# Altium schematic sheet Micro_Conection.SchDoc (part 2 of 3)
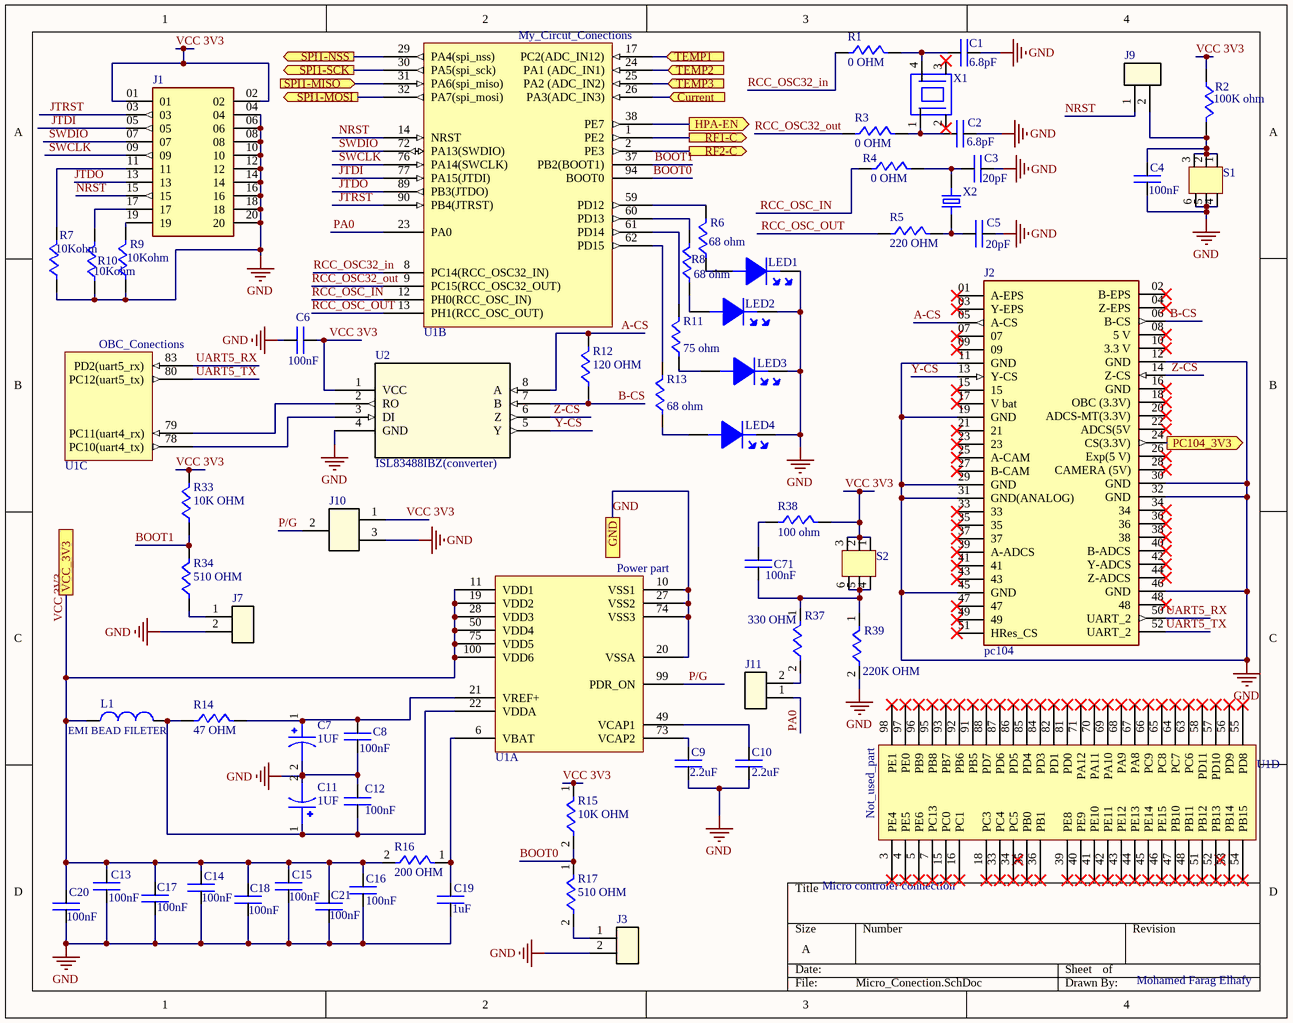
[diagram p1: Micro_Conection.SchDoc]
## Library data of the parts
C1 C2 = C_6.8pF: 6.8pF ±0.25pF 250V Ceramic Capacitor C0G, NP0 0805 (2012 Metric); Manufacturer: Yageo; Manufacturer Part Number: CC0805CRNPO0BN6R8; Supplier 1: Digi-Key; Stock 1: 10237; Pricing 1: 1 = 0.77000, 10 = 0.56500, 50 = 0.45220, 100 = 0.38760, 500 = 0.30682, 1000 = 0.25837 (USD); Mount: Surface Mount; Case/Package: 0805; Min Operating Temperature: -55°C; Max Operating Temperature: 125°C; Packaging: Tape and Reel; Voltage Rating: 100V; Length: 0.079inch; Width: 0.049inch; Thickness: 0.028inch; ComponentLink1URL: https://datasheet.ciiva.com/11611/product-11611526.pdf?src-supplier=Avnet; ComponentLink1Description: https://datasheet.ciiva.com/11611/product-11611526.pdf?src-supplier=Avnet; Supplier Part Number 1: 490-5292-1-ND; RoHS: Yes; Case Code (Imperial): 0805; Case Code (Metric): 2012; Package Quantity: 1; Dielectric: C0G; Termination: SMD/SMT; Voltage Rating (DC): 250V; Series: GQM; Construction: Flat; Height: 0.85mm; Depth: 1.25mm; Radiation Hardening: No; RoHS Compliant: Yes; ComponentLink2URL: https://datasheet.ciiva.com/5424/product-5424762.pdf?src-supplier=Mouser; ComponentLink2Description: https://datasheet.ciiva.com/5424/product-5424762.pdf?src-supplier=Mouser; ComponentLink3URL: https://datasheet.ciiva.com/141/partnumbering-e-01-141709.pdf?src-supplier=Digi-Key; ComponentLink3Description: https://datasheet.ciiva.com/141/partnumbering-e-01-141709.pdf?src-supplier=Digi-Key; ComponentLink4URL: https://datasheet.ciiva.com/141/partnumbering-e-01-141710.pdf?src-supplier=Digi-Key; ComponentLink4Description: https://datasheet.ciiva.com/141/partnumbering-e-01-141710.pdf?src-supplier=Digi-Key; ComponentLink5URL: https://datasheet.ciiva.com/141/partnumbering-e-01-141711.pdf?src-supplier=Digi-Key; ComponentLink5Description: https://datasheet.ciiva.com/141/partnumbering-e-01-141711.pdf?src-supplier=Digi-Key
C3 C5 = C_20pF: 20pF ±1% 25V Ceramic Capacitor C0G, NP0 0603 (1608 Metric); Manufacturer: Yageo; Manufacturer Part Number: CC0805CRNPO0BN6R8; Voltage Rating: 100V; Voltage Rating (DC): 16V; Tolerance: 5%; Mount: Surface Mount; Case/Package: 0805; Min Operating Temperature: -55°C; Max Operating Temperature: 125°C; Packaging: Tape and Reel; Length: 0.079inch; Width: 0.049inch; Thickness: 0.028inch; RoHS: Yes; Case Code (Imperial): 0805; Case Code (Metric): 2012; Weight: 0.000194oz; Dielectric Material: Ceramic; Package Quantity: 1; Dielectric: C0G; Termination: SMD/SMT; Height: 0.78mm; Depth: 1.25mm; Lead Free: Lead Free; Supplier 1: Digi-Key; ComponentLink1URL: https://datasheet.ciiva.com/11546/ccog-11546630.pdf?src-supplier=Avnet; ComponentLink1Description: https://datasheet.ciiva.com/11546/ccog-11546630.pdf?src-supplier=Avnet; ComponentLink2URL: https://datasheet.ciiva.com/5445/ccog-5445511.pdf?src-supplier=Mouser; ComponentLink2Description: https://datasheet.ciiva.com/5445/ccog-5445511.pdf?src-supplier=Mouser; ComponentLink3URL: https://datasheet.ciiva.com/203/ccog-203979.pdf?src-supplier=Digi-Key; ComponentLink3Description: https://datasheet.ciiva.com/203/ccog-203979.pdf?src-supplier=Digi-Key; Supplier Part Number 1: 399-9987-1-ND; Number of Pins: 2; Radiation Hardening: No
C4 C6 C8 C12-C18 C20 C21 C71 = C_100nF: 0.1µF ±10% 16V Ceramic Capacitor X7R 0805 (2012 Metric); Manufacturer: Johanson; Manufacturer Part Number: 160R15W104KV4T; Supplier 1: Digi-Key; RoHS: Yes; Stock 1: 45779; Pricing 1: 1 = 0.21000, 10 = 0.14200, 50 = 0.08520, 100 = 0.07190, 500 = 0.04920, 1000 = 0.04352 (USD); Mount: Surface Mount; Case/Package: 0805; Case Code (Imperial): 0805; Case Code (Metric): 2012; Min Operating Temperature: -55°C; Max Operating Temperature: 125°C; Tolerance: 10%; Packaging: Tape and Reel; Voltage Rating: 16V; Dielectric: X7R; Termination: SMD/SMT; Voltage Rating (DC): 16V; Package Quantity: 1; Length: 0.08inch; Width: 0.05inch; Thickness: 0.05inch; ComponentLink1URL: https://www.johansondielectrics.com/downloads/catalog/johanson-dielectrics-product-catalog.pdf; ComponentLink1Description: https://www.johansondielectrics.com/downloads/catalog/johanson-dielectrics-product-catalog.pdf; Supplier Part Number 1: 709-1183-1-ND; Series: -; RoHS Compliant: Yes
C7 C11 = C_1uF 1206: 1µF Molded Tantalum Capacitors 16V 1206 (3216 Metric) 11Ohm; Supplier 1: Future Electronics; Supplier Part Number 1: 4630448
C9 C10 = C_2.2uF: 2.2µF ±10% 25V Ceramic Capacitor X7R 0805 (2012 Metric); Manufacturer: Murata; Manufacturer Part Number: GRM21BR71E225KE11L; Voltage Rating: 6.3V; Supplier 1: Digi-Key; RoHS: No; Tolerance: 10%; Dielectric: X7R; Voltage Rating (DC): 25V; Length: 2mm; Width: 1.25mm; Thickness: 1.25mm; ComponentLink1URL: https://datasheet.ciiva.com/135/mlcc-all-e-135172.pdf?src-supplier=Digi-Key; ComponentLink1Description: https://datasheet.ciiva.com/135/mlcc-all-e-135172.pdf?src-supplier=Digi-Key; ComponentLink2URL: https://datasheet.ciiva.com/135/mlcc-all-e-135173.pdf?src-supplier=Digi-Key; ComponentLink2Description: https://datasheet.ciiva.com/135/mlcc-all-e-135173.pdf?src-supplier=Digi-Key; ComponentLink3URL: https://datasheet.ciiva.com/135/mlcc-all-e-135174.pdf?src-supplier=Digi-Key; ComponentLink3Description: https://datasheet.ciiva.com/135/mlcc-all-e-135174.pdf?src-supplier=Digi-Key; ComponentLink4URL: https://datasheet.ciiva.com/5423/mlcc-all-e-541559-5423227.pdf?src-supplier=Mouser; ComponentLink4Description: https://datasheet.ciiva.com/5423/mlcc-all-e-541559-5423227.pdf?src-supplier=Mouser; Supplier Part Number 1: 445-14535-1-ND; Mount: Surface Mount; Case/Package: 0805; Case Code (Metric): 2012; Case Code (Imperial): 0805; Min Operating Temperature: -55°C; Max Operating Temperature: 85°C; Packaging: Tape and Reel; Package Quantity: 1; Termination: SMD/SMT; Resistor Type: Ceramic; Height: 1.25mm; Depth: 1.25mm; Radiation Hardening: No; Lead Free: Lead Free
C19 = C_1uF: 1µF ±5% 16V Ceramic Capacitor X7R 0805 (2012 Metric); Manufacturer: Murata; Manufacturer Part Number: GRM219R61H105KA73D; Tolerance: 10%; Voltage Rating: 50V; Dielectric: X5R; Dissipation Factor: 0.025%; Supplier 1: Digi-Key; RoHS: Yes; Stock 1: 54905; Pricing 1: 1 = 0.38000, 10 = 0.26100, 50 = 0.17420, 100 = 0.14810, 500 = 0.10454, 1000 = 0.09148 (USD); Mount: Surface Mount; Case/Package: 0805; Number of Pins: 2; Case Code (Metric): 2012; Case Code (Imperial): 0805; Material: Ceramic; Weight: 0.000335oz; Dielectric Material: Ceramic; Min Operating Temperature: -55°C; Max Operating Temperature: 85°C; Packaging: Tape and Reel; Voltage: 50V; Termination: SMD/SMT; Resistor Type: Ceramic; Voltage Rating (DC): 50V; Package Quantity: 4000; Length: 2mm; Width: 1.25mm; Height: 0.85mm; Thickness: 0.037inch; Depth: 1.25mm; REACH SVHC: No SVHC; Lead Free: Lead Free; ComponentLink1URL: http://www.farnell.com/datasheets/2746093.pdf?src-supplier=Farnell; ComponentLink1Description: http://www.farnell.com/datasheets/2746093.pdf?src-supplier=Farnell; Supplier Part Number 1: 399-8001-1-ND; Features: Soft Termination; Ratings: AEC-Q200; Radiation Hardening: No; Series: C; Construction: Flat; Lead Pitch: 0.75mm; RoHS Compliant: Yes
J1 = JTAG: Connector Header Through Hole 20 position 0.100" (2.54mm); Supplier 1: Digi-Key; Supplier Part Number 1: 609-1776-ND; ComponentLink1URL: https://datasheet.ciiva.com/11746/0900766b80d79252-11746787.pdf?src-supplier=RSComponents; ComponentLink1Description: https://datasheet.ciiva.com/11746/0900766b80d79252-11746787.pdf?src-supplier=RSComponents; ComponentLink2URL: https://datasheet.ciiva.com/8046/8378-8046504.pdf?src-supplier=Element14; ComponentLink2Description: https://datasheet.ciiva.com/8046/8378-8046504.pdf?src-supplier=Element14; ComponentLink3URL: https://datasheet.ciiva.com/713/75869-713538.pdf?src-supplier=Digi-Key; ComponentLink3Description: https://datasheet.ciiva.com/713/75869-713538.pdf?src-supplier=Digi-Key; ComponentLink4URL: https://datasheet.ciiva.com/14640/70236764-14640853.pdf?src-supplier=Allied+Electronics; ComponentLink4Description: https://datasheet.ciiva.com/14640/70236764-14640853.pdf?src-supplier=Allied+Electronics; ComponentLink5URL: https://datasheet.ciiva.com/3118/75869-3118553.pdf?src-supplier=Avnet; ComponentLink5Description: https://datasheet.ciiva.com/3118/75869-3118553.pdf?src-supplier=Avnet
J3 J7 J9 J11 = jumber 2 leads: Connector Header Through Hole 2 position 0.100" (2.54mm); Manufacturer: Wurth Electronics; Manufacturer Part Number: 61300211121; Current Rating: 3A; Voltage Rating: 250V; Number of Positions: 2; Gender: Male; Connector Type: Male Pin; Pitch: 0.1inch; Supplier 1: Digi-Key; Supplier Part Number 1: 732-5315-ND; RoHS: Yes; Stock 1: 60555; Pricing 1: 1 = 0.13000, 10 = 0.10600, 25 = 0.08800, 50 = 0.07400, 100 = 0.06700, 1000 = 0.06100 (USD); Mount: Through Hole; Contact Plating: Gold; Housing Material: PBT; Contact Material: Copper Alloy,Copper; Color: Black; Min Operating Temperature: -40°C; Max Operating Temperature: 125°C; Number of Rows: 1; Contact Gender: Male; Packaging: Bulk; Termination: Through Hole; Number of Contacts: 2; Contact Mating Length: 0.236inch; REACH SVHC: Unknown; Lead Free: Lead Free; ComponentLink1URL: https://datasheet.ciiva.com/13619/6130xx11121-48870-13619345.pdf?src-supplier=Mouser; ComponentLink1Description: https://datasheet.ciiva.com/13619/6130xx11121-48870-13619345.pdf?src-supplier=Mouser
J10 = jumber: Connector Header Through Hole 3 position 0.100" (2.54mm); Manufacturer: Harwin; Manufacturer Part Number: M20-9990345; Contact Resistance: 25mR; Max Current Rating: 3A; Number of Positions: 3; Connector Type: Male Pin; Insulation Resistance: 10GR; Voltage Rating (AC): 750V; Gender: Male; RoHS: Yes; Mount: Through Hole; Case/Package: SIL; Contact Material: Brass,Bronze; Color: Black; Housing Color: Black; Housing Material: Nylon; Contact Plating: Gold; Weight: 0.006138oz; Min Operating Temperature: -40°C; Max Operating Temperature: 105°C; Number of Rows: 1; Package Quantity: 1000; Packaging: Bulk; Termination: Solder; Number of Contacts: 3; Orientation: Straight; Current Rating: 3A; Series: M20; Contact Type: Male Pin; Length: 7.62mm; Width: 0.25inch; Height: 0.125inch; Pitch: 2.54mm; Depth: 2.54mm; Contact Mating Length: 0.24inch; Radiation Hardening: No; REACH SVHC: No SVHC; RoHS Compliant: Yes; Supplier 1: Digi-Key; Stock 1: 36526; Pricing 1: 1 = 0.13000, 10 = 0.10600, 25 = 0.08800, 50 = 0.07400, 100 = 0.06700, 1000 = 0.06100 (USD); Lead Free: Lead Free; ComponentLink1URL: http://www.farnell.com/cad/1737268.pdf?src-supplier=Element14; ComponentLink1Description: http://www.farnell.com/cad/1737268.pdf?src-supplier=Element14; ComponentLink2URL: https://katalog.we-online.de/em/datasheet/6130xx11121.pdf?src-supplier=Digi-Key; ComponentLink2Description: https://katalog.we-online.de/em/datasheet/6130xx11121.pdf?src-supplier=Digi-Key; Supplier Part Number 1: 732-5316-ND
L1 = FCM1608-0603: 60 Ohms @ 100MHz 1 Power Line Ferrite Bead 0805 (2012 Metric) 3A 25mOhm; Supplier 1: Digi-Key; Supplier Part Number 1: 587-1932-1-ND
LED1 = LED_GREEN: Green 568nm LED Indication - Discrete 2V 0805 (2012 Metric); Manufacturer: Vishay Lite-On; Manufacturer Part Number: LTST-S220KGKT; Lens Color: Colorless; Viewing Angle: 130°; Luminous Intensity: 35mcd; Forward Current: 30mA; Lens Style: Diffused,Colorless,Rectangular,Clear; Power Rating: 75mW; Dominant Wavelength: 571nm; Test Current: 20mA; Number of Elements: 1; Wavelength: 574nm; Reverse Voltage: 5V; Supplier 1: Digi-Key; ComponentLink1Description: https://www.digikey.com/en/products/detail/lite-on-inc/LTST-C191KGKT/386835; ComponentLink1URL: https://www.digikey.com/en/products/detail/lite-on-inc/LTST-C191KGKT/386835; Supplier Part Number 1: 160-1468-1-ND; ComponentLink2Description: data sheet; ComponentLink2URL: https://optoelectronics.liteon.com/upload/download/DS22-2000-228/LTST-C191KGKT.PDF; RoHS: Yes; Stock 1: 90822; Pricing 1: 1 = 0.26000, 10 = 0.14200, 100 = 0.06600, 500 = 0.06090, 1000 = 0.04770, 2000 = 0.04669 (USD); Mount: Surface Mount; Case/Package: 0805; Number of Pins: 2; Color: Green; Case Code (Metric): 2012; Case Code (Imperial): 0805; Min Operating Temperature: -55°C; Max Operating Temperature: 85°C; Forward Voltage: 2V; Packaging: Tape and Reel; Package Quantity: 1; Illumination Color: Green; Lens Transparency: Clear; Power Dissipation: 75mW; Number of LEDs: 1; Length: 2.1mm; Width: 1mm; Height: 0.6mm; Depth: 0.6mm; Radiation Hardening: No; Lead Free: Lead Free; RoHS Compliant: Yes; ComponentLink3URL: https://datasheet.ciiva.com/11775/0900766b80dc0b70-11775441.pdf?src-supplier=RSComponents; ComponentLink3Description: https://datasheet.ciiva.com/11775/0900766b80dc0b70-11775441.pdf?src-supplier=RSComponents; ComponentLink4URL: https://datasheet.ciiva.com/12400/100-ltst-s220kgkt-59602-12400886.pdf?src-supplier=Mouser; ComponentLink4Description: https://datasheet.ciiva.com/12400/100-ltst-s220kgkt-59602-12400886.pdf?src-supplier=Mouser; ComponentLink5URL: https://datasheet.ciiva.com/2110/s-110-ltst-s220kgkt-2110069.pdf?src-supplier=Digi-Key; ComponentLink5Description: https://datasheet.ciiva.com/2110/s-110-ltst-s220kgkt-2110069.pdf?src-supplier=Digi-Key; ComponentLink6URL: https://datasheet.ciiva.com/2110/s-110-ltst-s220kgkt-2110070.pdf?src-supplier=Digi-Key; ComponentLink6Description: https://datasheet.ciiva.com/2110/s-110-ltst-s220kgkt-2110070.pdf?src-supplier=Digi-Key; ComponentLink7URL: https://datasheet.ciiva.com/2110/s-110-ltst-s220kgkt-2110071.pdf?src-supplier=Digi-Key; ComponentLink7Description: https://datasheet.ciiva.com/2110/s-110-ltst-s220kgkt-2110071.pdf?src-supplier=Digi-Key; ComponentLink8URL: https://datasheet.ciiva.com/16379/ltst-s220kgkt-16379082.pdf?src-supplier=Future+Electronics; ComponentLink8Description: https://datasheet.ciiva.com/16379/ltst-s220kgkt-16379082.pdf?src-supplier=Future+Electronics
LED2 = LED_ORANGE: Orange 605nm LED Indication - Discrete 2V 0805 (2012 Metric); Manufacturer: Vishay Lite-On; Manufacturer Part Number: LTST-C170KFKT; Lens Color: Colorless; Wavelength: 611nm; Number of LEDs: 1; Viewing Angle: 130°; Lens Style: Diffused,Colorless,Rectangular,Clear; Luminous Intensity: 60mcd; Forward Current: 30mA; Power Rating: 75mW; Reverse Voltage: 5V; Test Current: 20mA; ComponentLink1Description: https://www.digikey.com/en/products/detail/lite-on-inc/LTST-C191KGKT/386835; ComponentLink1URL: https://www.digikey.com/en/products/detail/lite-on-inc/LTST-C191KGKT/386835; ComponentLink2Description: data sheet; ComponentLink2URL: https://optoelectronics.liteon.com/upload/download/DS22-2000-228/LTST-C191KGKT.PDF; RoHS: Yes; Mount: Surface Mount; Case/Package: 0805; Number of Pins: 2; Case Code (Metric): 2012; Color: Orange; Case Code (Imperial): 0805; Min Operating Temperature: -55°C; Max Operating Temperature: 85°C; Package Quantity: 1; Packaging: Tape and Reel; Forward Voltage: 2V; Illumination Color: Orange; Dominant Wavelength: 605nm; Lens Transparency: Clear; Number of Elements: 1; Power Dissipation: 75mW; Length: 3.2mm; Width: 1.25mm; Height: 1.1mm; Depth: 1.6mm; Radiation Hardening: No; Lead Free: Lead Free; ComponentLink3URL: https://datasheet.ciiva.com/2109/ltst-c191kfkt-2109968.pdf?src-supplier=Digi-Key; ComponentLink3Description: https://datasheet.ciiva.com/2109/ltst-c191kfkt-2109968.pdf?src-supplier=Digi-Key; ComponentLink4URL: https://datasheet.ciiva.com/12400/100-ltst-c191kfkt-39904-12400811.pdf?src-supplier=Mouser; ComponentLink4Description: https://datasheet.ciiva.com/12400/100-ltst-c191kfkt-39904-12400811.pdf?src-supplier=Mouser; ComponentLink5URL: https://datasheet.ciiva.com/11775/0900766b80dc02b0-11775613.pdf?src-supplier=RSComponents; ComponentLink5Description: https://datasheet.ciiva.com/11775/0900766b80dc02b0-11775613.pdf?src-supplier=RSComponents; ComponentLink6URL: https://datasheet.ciiva.com/15201/getdatasheetpartid-631075-15201391.pdf?src-supplier=Verical; ComponentLink6Description: https://datasheet.ciiva.com/15201/getdatasheetpartid-631075-15201391.pdf?src-supplier=Verical; ComponentLink7URL: https://datasheet.ciiva.com/2109/s-110-ltst-c191kfkt-2109969.pdf?src-supplier=Digi-Key; ComponentLink7Description: https://datasheet.ciiva.com/2109/s-110-ltst-c191kfkt-2109969.pdf?src-supplier=Digi-Key; Supplier 1: Digi-Key; Stock 1: 7029; Pricing 1: 1 = 0.28000, 10 = 0.15000, 100 = 0.06990, 500 = 0.06450, 1000 = 0.05052 (USD); Supplier Part Number 1: 160-1413-1-ND; RoHS Compliant: Yes; ComponentLink8URL: https://datasheet.ciiva.com/15117/getdatasheetpartid-158266-15117926.pdf?src-supplier=Verical; ComponentLink8Description: https://datasheet.ciiva.com/15117/getdatasheetpartid-158266-15117926.pdf?src-supplier=Verical; ComponentLink9URL: https://datasheet.ciiva.com/11773/0900766b80dc0279-11773662.pdf?src-supplier=RSComponents; ComponentLink9Description: https://datasheet.ciiva.com/11773/0900766b80dc0279-11773662.pdf?src-supplier=RSComponents; ComponentLink10URL: https://datasheet.ciiva.com/12403/lite-on-ltst-c170kfkt-187690-12403821.pdf?src-supplier=Mouser; ComponentLink10Description: https://datasheet.ciiva.com/12403/lite-on-ltst-c170kfkt-187690-12403821.pdf?src-supplier=Mouser; ComponentLink11URL: https://datasheet.ciiva.com/2110/s-110-ltst-c170kfkt-2110076.pdf?src-supplier=Digi-Key; ComponentLink11Description: https://datasheet.ciiva.com/2110/s-110-ltst-c170kfkt-2110076.pdf?src-supplier=Digi-Key; ComponentLink12URL: https://datasheet.ciiva.com/2110/s-110-ltst-c170kfkt-2110077.pdf?src-supplier=Digi-Key; ComponentLink12Description: https://datasheet.ciiva.com/2110/s-110-ltst-c170kfkt-2110077.pdf?src-supplier=Digi-Key; ComponentLink13URL: https://datasheet.ciiva.com/2110/s-110-ltst-c170kfkt-2110075.pdf?src-supplier=Digi-Key; ComponentLink13Description: https://datasheet.ciiva.com/2110/s-110-ltst-c170kfkt-2110075.pdf?src-supplier=Digi-Key; ComponentLink14URL: https://datasheet.ciiva.com/16427/ltst-c170kfkt-16427484.pdf?src-supplier=Future+Electronics; ComponentLink14Description: https://datasheet.ciiva.com/16427/ltst-c170kfkt-16427484.pdf?src-supplier=Future+Electronics
LED3 = LED_RED: Red 638nm LED Indication - Discrete 1.8V 0805 (2012 Metric); Manufacturer: Vishay Lite-On; Manufacturer Part Number: LTST-C170CKT; Lens Color: Colorless; Power Rating: 100mW; Luminous Intensity: 10mcd; Viewing Angle: 130°; Lens Style: Diffused,Colorless,Rectangular,Clear; Forward Current: 40mA; Test Current: 10mA; Number of Elements: 1; Wavelength: 660nm; Voltage: 5V; ComponentLink1Description: https://www.digikey.com/en/products/detail/lite-on-inc/LTST-C191KGKT/386835; ComponentLink1URL: https://www.digikey.com/en/products/detail/lite-on-inc/LTST-C191KGKT/386835; ComponentLink2Description: data sheet; ComponentLink2URL: https://optoelectronics.liteon.com/upload/download/DS22-2000-228/LTST-C191KGKT.PDF; Supplier 1: Digi-Key; RoHS: Yes; Stock 1: 26138; Pricing 1: 1 = 0.35000, 10 = 0.18800, 100 = 0.08740, 500 = 0.08070, 1000 = 0.06322 (USD); Mount: Surface Mount; Case/Package: 0805; Number of Pins: 2; Color: Red; Case Code (Metric): 2012; Case Code (Imperial): 0805; Min Operating Temperature: -55°C; Max Operating Temperature: 85°C; Packaging: Tape and Reel; Forward Voltage: 1.8V; Package Quantity: 1; Illumination Color: Red; Dominant Wavelength: 638nm; Lens Transparency: Clear; Power Dissipation: 100mW; Number of LEDs: 1; Reverse Voltage: 5V; Length: 2mm; Width: 1.25mm; Height: 1.1mm; Depth: 1.25mm; Radiation Hardening: No; Lead Free: Lead Free; ComponentLink3URL: https://datasheet.ciiva.com/11773/0900766b80dc02b2-11773601.pdf?src-supplier=RSComponents; ComponentLink3Description: https://datasheet.ciiva.com/11773/0900766b80dc02b2-11773601.pdf?src-supplier=RSComponents; ComponentLink4URL: https://datasheet.ciiva.com/16212/ltst-c191krkt-16212419.pdf?src-supplier=Future+Electronics; ComponentLink4Description: https://datasheet.ciiva.com/16212/ltst-c191krkt-16212419.pdf?src-supplier=Future+Electronics; ComponentLink5URL: https://datasheet.ciiva.com/15117/getdatasheetpartid-141922-15117737.pdf?src-supplier=Verical; ComponentLink5Description: https://datasheet.ciiva.com/15117/getdatasheetpartid-141922-15117737.pdf?src-supplier=Verical; ComponentLink6URL: https://datasheet.ciiva.com/12400/lite-on-ltst-c191krkt-190135-12400910.pdf?src-supplier=Mouser; ComponentLink6Description: https://datasheet.ciiva.com/12400/lite-on-ltst-c191krkt-190135-12400910.pdf?src-supplier=Mouser; ComponentLink7URL: https://datasheet.ciiva.com/2109/s-110-ltst-c191krkt-2109970.pdf?src-supplier=Digi-Key; ComponentLink7Description: https://datasheet.ciiva.com/2109/s-110-ltst-c191krkt-2109970.pdf?src-supplier=Digi-Key; ComponentLink8URL: https://datasheet.ciiva.com/2109/s-110-ltst-c191krkt-2109971.pdf?src-supplier=Digi-Key; ComponentLink8Description: https://datasheet.ciiva.com/2109/s-110-ltst-c191krkt-2109971.pdf?src-supplier=Digi-Key; ComponentLink9URL: https://datasheet.ciiva.com/2109/s-110-ltst-c191krkt-2109972.pdf?src-supplier=Digi-Key; ComponentLink9Description: https://datasheet.ciiva.com/2109/s-110-ltst-c191krkt-2109972.pdf?src-supplier=Digi-Key; Supplier Part Number 1: 160-1176-1-ND; Max Power Dissipation: 100mW; Series: -; RoHS Compliant: Yes; ComponentLink10URL: https://datasheet.ciiva.com/2110/ltst-c170ckt-2110087.pdf?src-supplier=Digi-Key; ComponentLink10Description: https://datasheet.ciiva.com/2110/ltst-c170ckt-2110087.pdf?src-supplier=Digi-Key; ComponentLink11URL: https://datasheet.ciiva.com/15117/getdatasheetpartid-121078-15117607.pdf?src-supplier=Verical; ComponentLink11Description: https://datasheet.ciiva.com/15117/getdatasheetpartid-121078-15117607.pdf?src-supplier=Verical; ComponentLink12URL: https://datasheet.ciiva.com/16199/lite-on20ltst-c170ckt-16199245.pdf?src-supplier=Future+Electronics; ComponentLink12Description: https://datasheet.ciiva.com/16199/lite-on20ltst-c170ckt-16199245.pdf?src-supplier=Future+Electronics; ComponentLink13URL: https://datasheet.ciiva.com/11775/0900766b80dc0276-11775646.pdf?src-supplier=RSComponents; ComponentLink13Description: https://datasheet.ciiva.com/11775/0900766b80dc0276-11775646.pdf?src-supplier=RSComponents; ComponentLink14URL: https://datasheet.ciiva.com/2110/ltst-c170ckt-2110088.pdf?src-supplier=Digi-Key; ComponentLink14Description: https://datasheet.ciiva.com/2110/ltst-c170ckt-2110088.pdf?src-supplier=Digi-Key; ComponentLink15URL: https://datasheet.ciiva.com/2110/ltst-c170ckt-2110089.pdf?src-supplier=Digi-Key; ComponentLink15Description: https://datasheet.ciiva.com/2110/ltst-c170ckt-2110089.pdf?src-supplier=Digi-Key; ComponentLink16URL: https://datasheet.ciiva.com/27051/1260306-27051787.pdf?src-supplier=Jameco; ComponentLink16Description: https://datasheet.ciiva.com/27051/1260306-27051787.pdf?src-supplier=Jameco
LED4 = LED_YELLOW: Yellow 591nm LED Indication - Discrete 2.1V 0805 (2012 Metric); Manufacturer: Vishay Lite-On; Manufacturer Part Number: LTST-C170KSKT; Lens Color: Colorless; Reverse Voltage: 5V; Number of LEDs: 1; Viewing Angle: 130°; Lens Style: Diffused,Colorless,Rectangular,Clear; Luminous Intensity: 112mcd; Forward Current: 30mA; Forward Voltage: 2.4V; Power Rating: 75mW; Wavelength: 588nm; Dominant Wavelength: 587nm; Test Current: 20mA; Supplier 1: Digi-Key; RoHS: Yes; Stock 1: 67488; Pricing 1: 1 = 0.31000, 10 = 0.16900, 100 = 0.07860, 500 = 0.07260, 1000 = 0.05687 (USD); Mount: Surface Mount; Case/Package: 0805; Number of Pins: 2; Case Code (Imperial): 0805; Color: Yellow; Case Code (Metric): 2012; Min Operating Temperature: -55°C; Max Operating Temperature: 85°C; Package Quantity: 1; Packaging: Tape and Reel; Illumination Color: Yellow; Lens Transparency: Clear; Number of Elements: 1; Power Dissipation: 75mW; Length: 2mm; Width: 1.25mm; Height: 1.1mm; Depth: 1.25mm; Radiation Hardening: No; Lead Free: Lead Free; ComponentLink1URL: https://datasheet.ciiva.com/16213/lite-on20ltst-c191kskt-16213725.pdf?src-supplier=Future+Electronics; ComponentLink1Description: https://datasheet.ciiva.com/16213/lite-on20ltst-c191kskt-16213725.pdf?src-supplier=Future+Electronics; ComponentLink2URL: https://datasheet.ciiva.com/12400/lite-on-ltst-c191kskt-190097-12400797.pdf?src-supplier=Mouser; ComponentLink2Description: https://datasheet.ciiva.com/12400/lite-on-ltst-c191kskt-190097-12400797.pdf?src-supplier=Mouser; ComponentLink3URL: https://datasheet.ciiva.com/15117/getdatasheetpartid-141495-15117732.pdf?src-supplier=Verical; ComponentLink3Description: https://datasheet.ciiva.com/15117/getdatasheetpartid-141495-15117732.pdf?src-supplier=Verical; ComponentLink4URL: https://datasheet.ciiva.com/11773/0900766b80dc02b3-11773512.pdf?src-supplier=RSComponents; ComponentLink4Description: https://datasheet.ciiva.com/11773/0900766b80dc02b3-11773512.pdf?src-supplier=RSComponents; ComponentLink5URL: https://datasheet.ciiva.com/2109/s-110-ltst-c191kskt-2109984.pdf?src-supplier=Digi-Key; ComponentLink5Description: https://datasheet.ciiva.com/2109/s-110-ltst-c191kskt-2109984.pdf?src-supplier=Digi-Key; Supplier Part Number 1: 160-1416-1-ND; Series: CHIPLED 0805; RoHS Compliant: Yes; ComponentLink6URL: https://datasheet.ciiva.com/15118/getdatasheetpartid-214541-15118098.pdf?src-supplier=Verical; ComponentLink6Description: https://datasheet.ciiva.com/15118/getdatasheetpartid-214541-15118098.pdf?src-supplier=Verical; ComponentLink7URL: https://datasheet.ciiva.com/11774/0900766b80dc027c-11774116.pdf?src-supplier=RSComponents; ComponentLink7Description: https://datasheet.ciiva.com/11774/0900766b80dc027c-11774116.pdf?src-supplier=RSComponents; ComponentLink8URL: https://datasheet.ciiva.com/16203/ltst-c170kskt-16203829.pdf?src-supplier=Future+Electronics; ComponentLink8Description: https://datasheet.ciiva.com/16203/ltst-c170kskt-16203829.pdf?src-supplier=Future+Electronics; ComponentLink9URL: https://datasheet.ciiva.com/12400/lite-on-ltst-c170kskt-187240-12400806.pdf?src-supplier=Mouser; ComponentLink9Description: https://datasheet.ciiva.com/12400/lite-on-ltst-c170kskt-187240-12400806.pdf?src-supplier=Mouser; ComponentLink10URL: https://datasheet.ciiva.com/2110/s-110-ltst-c170kskt-2110045.pdf?src-supplier=Digi-Key; ComponentLink10Description: https://datasheet.ciiva.com/2110/s-110-ltst-c170kskt-2110045.pdf?src-supplier=Digi-Key; ComponentLink11URL: https://datasheet.ciiva.com/2110/s-110-ltst-c170kskt-2110046.pdf?src-supplier=Digi-Key; ComponentLink11Description: https://datasheet.ciiva.com/2110/s-110-ltst-c170kskt-2110046.pdf?src-supplier=Digi-Key; ComponentLink12URL: https://datasheet.ciiva.com/2110/s-110-ltst-c170kskt-2110047.pdf?src-supplier=Digi-Key; ComponentLink12Description: https://datasheet.ciiva.com/2110/s-110-ltst-c170kskt-2110047.pdf?src-supplier=Digi-Key
R1 R3 R4 = R_0 ohm: 0 Ohms Jumper 0.125W, 1/8W Chip Resistor 0805 (2012 Metric)  Thick Film; Manufacturer: Vishay; Manufacturer Part Number: CRCW08050000Z0EAC; Power Rating: 125mW; Resistance: 20R; Supplier 1: Digi-Key; RoHS: Yes; Stock 1: 101527; Pricing 1: 1 = 0.10000, 10 = 0.03500, 100 = 0.01420, 1000 = 0.00636, 2500 = 0.00552 (USD); Mount: Surface Mount; Case/Package: Molded; Contact Plating: Tin; Min Operating Temperature: -55°C; Max Operating Temperature: 155°C; Resistor Type: Thick Film; Termination: Wraparound; Length: 2mm; Lead Free: Lead Free; ComponentLink1URL: http://www.vishay.com/docs/28773/crcwce3.pdf?src-supplier=Digi-Key; ComponentLink1Description: http://www.vishay.com/docs/28773/crcwce3.pdf?src-supplier=Digi-Key; Supplier Part Number 1: 541-4125-1-ND; RoHS Compliant: Yes
R2 = R_100k ohm: 100 kOhms ±1% 0.5W, 1/2W Chip Resistor 0805 (2012 Metric) Automotive AEC-Q200, Pulse Withstanding Thick Film; Manufacturer: Vishay; Manufacturer Part Number: CRCW08050000Z0EAC; Power Rating: 125mW; Resistance: 20R; Voltage Rating: 150V; Temperature Coefficient: 100ppm/°C; RoHS: Yes; Mount: Surface Mount; Case/Package: Molded; Contact Plating: Tin; Min Operating Temperature: -55°C; Max Operating Temperature: 155°C; Resistor Type: Thick Film; Termination: Wraparound; Length: 2mm; Lead Free: Lead Free; ComponentLink1URL: http://www.vishay.com/docs/28773/crcwce3.pdf?src-supplier=Digi-Key; ComponentLink1Description: http://www.vishay.com/docs/28773/crcwce3.pdf?src-supplier=Digi-Key; Supplier 1: Digi-Key; Stock 1: 56069; Pricing 1: 1 = 0.16000, 10 = 0.13400, 100 = 0.05250, 1000 = 0.02196, 2500 = 0.02013 (USD); Number of Pins: 2; Case Code (Imperial): 0805; Case Code (Metric): 2012; Tolerance: 1%; Packaging: Tape and Reel; Package Quantity: 5000; Voltage Rating (DC): 150V; Width: 1.2mm; Height: 0.6mm; Depth: 1.25mm; Radiation Hardening: No; REACH SVHC: No SVHC; Military Standard: Not; RoHS Compliant: Yes; ComponentLink2URL: https://datasheet.ciiva.com/11811/0900766b812cb812-11811747.pdf?src-supplier=RSComponents; ComponentLink2Description: https://datasheet.ciiva.com/11811/0900766b812cb812-11811747.pdf?src-supplier=RSComponents; ComponentLink3URL: https://datasheet.ciiva.com/17208/aoa0000ce4-17208166.pdf?src-supplier=Avnet+Europe; ComponentLink3Description: https://datasheet.ciiva.com/17208/aoa0000ce4-17208166.pdf?src-supplier=Avnet+Europe; ComponentLink4URL: https://datasheet.ciiva.com/48426/erjp-series-eng-tds-48426780.pdf?src-supplier=Distrelec; ComponentLink4Description: https://datasheet.ciiva.com/48426/erjp-series-eng-tds-48426780.pdf?src-supplier=Distrelec; ComponentLink5URL: https://datasheet.ciiva.com/24028/aoa0000ce4-64075-24028213.pdf?src-supplier=Mouser; ComponentLink5Description: https://datasheet.ciiva.com/24028/aoa0000ce4-64075-24028213.pdf?src-supplier=Mouser; ComponentLink6URL: https://datasheet.ciiva.com/9186/aoa0000ce4-9186934.pdf?src-supplier=Avnet; ComponentLink6Description: https://datasheet.ciiva.com/9186/aoa0000ce4-9186934.pdf?src-supplier=Avnet; ComponentLink7URL: https://datasheet.ciiva.com/30062/aoa0000ce4-30062057.pdf?src-supplier=Onlinecomponents.com; ComponentLink7Description: https://datasheet.ciiva.com/30062/aoa0000ce4-30062057.pdf?src-supplier=Onlinecomponents.com; ComponentLink8URL: https://datasheet.ciiva.com/22758/1801181-22758284.pdf?src-supplier=Farnell; ComponentLink8Description: https://datasheet.ciiva.com/22758/1801181-22758284.pdf?src-supplier=Farnell; ComponentLink9URL: https://datasheet.ciiva.com/22758/1801181-22758285.pdf?src-supplier=Farnell; ComponentLink9Description: https://datasheet.ciiva.com/22758/1801181-22758285.pdf?src-supplier=Farnell; Supplier Part Number 1: P16060CT-ND
R5 = R_220 ohm: 220 Ohms ±1% 0.125W, 1/8W Chip Resistor 0805 (2012 Metric) Automotive AEC-Q200 Thick Film; Manufacturer: Panasonic; Manufacturer Part Number: ERJ-P6WF2200V; Max Power Dissipation: 500mW; Temperature Coefficient: 200ppm/°C; Resistance: 220R; Voltage Rating: 150V; Resistance Tolerance: 5%; Supplier 1: Digi-Key; RoHS: Yes; Stock 1: 417690; Pricing 1: 1 = 0.10000, 10 = 0.06500, 100 = 0.02500, 1000 = 0.01100, 2500 = 0.00950 (USD); Case/Package: 0805; Case Code (Imperial): 0805; Case Code (Metric): 2012; Contact Plating: Tin; Min Operating Temperature: -55°C; Max Operating Temperature: 155°C; Number of Terminations: 2; Termination: Flat; Features: Automotive AEC-Q200; Power Rating: 500mW; Tolerance: 1%; Packaging: Cut Tape; Resistor Type: Thick Film; Voltage Rating (DC): 150V; Length: 0.079inch; Width: 0.049inch; Height: 0.03inch; Depth: 1.25mm; REACH SVHC: No SVHC; ComponentLink1URL: https://datasheet.ciiva.com/17206/aoa0000ce4-17206853.pdf?src-supplier=Avnet+Europe; ComponentLink1Description: https://datasheet.ciiva.com/17206/aoa0000ce4-17206853.pdf?src-supplier=Avnet+Europe; Supplier Part Number 1: P220CCT-ND; Mount: Surface Mount; Package Quantity: 1; Series: ERJ; Construction: Rectangular; Radiation Hardening: No; Military Standard: Not; Lead Free: Lead Free; RoHS Compliant: Yes; ComponentLink2URL: https://datasheet.ciiva.com/7887/aoa0000ce4-7887046.pdf?src-supplier=Element14; ComponentLink2Description: https://datasheet.ciiva.com/7887/aoa0000ce4-7887046.pdf?src-supplier=Element14; ComponentLink3URL: https://datasheet.ciiva.com/9184/aoa0000ce4-9184454.pdf?src-supplier=Avnet; ComponentLink3Description: https://datasheet.ciiva.com/9184/aoa0000ce4-9184454.pdf?src-supplier=Avnet; ComponentLink4URL: https://datasheet.ciiva.com/30254/aoa0000ce4-30254695.pdf?src-supplier=Onlinecomponents.com; ComponentLink4Description: https://datasheet.ciiva.com/30254/aoa0000ce4-30254695.pdf?src-supplier=Onlinecomponents.com; ComponentLink5URL: https://datasheet.ciiva.com/6139/aoa0000ce4-6139150.pdf?src-supplier=Farnell; ComponentLink5Description: https://datasheet.ciiva.com/6139/aoa0000ce4-6139150.pdf?src-supplier=Farnell; Number of Pins: 2; Technology: THICK FILM; ComponentLink6URL: https://datasheet.ciiva.com/11821/0900766b80f80784-11821561.pdf?src-supplier=RSComponents; ComponentLink6Description: https://datasheet.ciiva.com/11821/0900766b80f80784-11821561.pdf?src-supplier=RSComponents; ComponentLink7URL: https://datasheet.ciiva.com/26914/getdatasheetpartid-123856-26914677.pdf?src-supplier=Verical; ComponentLink7Description: https://datasheet.ciiva.com/26914/getdatasheetpartid-123856-26914677.pdf?src-supplier=Verical; ComponentLink8URL: https://datasheet.ciiva.com/43511/aoa0000ce2-43511461.pdf?src-supplier=Onlinecomponents.com; ComponentLink8Description: https://datasheet.ciiva.com/43511/aoa0000ce2-43511461.pdf?src-supplier=Onlinecomponents.com; ComponentLink9URL: https://datasheet.ciiva.com/7887/426256-7887031.pdf?src-supplier=Element14; ComponentLink9Description: https://datasheet.ciiva.com/7887/426256-7887031.pdf?src-supplier=Element14; ComponentLink10URL: https://datasheet.ciiva.com/28568/1678782-28568983.pdf?src-supplier=Element14; ComponentLink10Description: https://datasheet.ciiva.com/28568/1678782-28568983.pdf?src-supplier=Element14; ComponentLink11URL: https://datasheet.ciiva.com/16771/70260748-16771368.pdf?src-supplier=Allied+Electronics; ComponentLink11Description: https://datasheet.ciiva.com/16771/70260748-16771368.pdf?src-supplier=Allied+Electronics; ComponentLink12URL: https://datasheet.ciiva.com/16784/70260748-16784746.pdf?src-supplier=Allied+Electronics; ComponentLink12Description: https://datasheet.ciiva.com/16784/70260748-16784746.pdf?src-supplier=Allied+Electronics; ComponentLink13URL: https://datasheet.ciiva.com/22668/1678782-22668331.pdf?src-supplier=Element14; ComponentLink13Description: https://datasheet.ciiva.com/22668/1678782-22668331.pdf?src-supplier=Element14; ComponentLink14URL: https://datasheet.ciiva.com/9184/aoa0000ce2-9184302.pdf?src-supplier=Avnet; ComponentLink14Description: https://datasheet.ciiva.com/9184/aoa0000ce2-9184302.pdf?src-supplier=Avnet
R6 R8 R13 = R_68 ohm: 68 Ohms ±5% 0.25W, 1/4W Chip Resistor 0805 (2012 Metric) Automotive AEC-Q200, Pulse Withstanding Thick Film; Manufacturer: Stackpole Electronics; Manufacturer Part Number: RPC0805JT68R0; Max Power Dissipation: 250mW; Temperature Coefficient: 200ppm/°C; ComponentLink1URL: https://www.seielect.com/Catalog/SEI-rpc.pdf?src-supplier=Digi-Key; ComponentLink1Description: https://www.seielect.com/Catalog/SEI-rpc.pdf?src-supplier=Digi-Key; ComponentLink2URL: https://www.seielect.com/catalog/SEI-Packaging.pdf?src-supplier=Digi-Key; ComponentLink2Description: https://www.seielect.com/catalog/SEI-Packaging.pdf?src-supplier=Digi-Key; Supplier 1: Digi-Key; RoHS: Yes; Stock 1: 6646; Pricing 1: 1 = 0.17000, 10 = 0.14300, 100 = 0.05590, 1000 = 0.02340, 2500 = 0.02145 (USD); Mount: Surface Mount; Case/Package: 0805; Case Code (Metric): 2012; Case Code (Imperial): 0805; Min Operating Temperature: -55°C; Max Operating Temperature: 155°C; Tolerance: 5%; Packaging: Tape and Reel; Resistor Type: Thick Film; Number of Terminations: 2; Features: Automotive AEC-Q200; Series: RPC; Length: 0.079inch; Width: 0.049inch; Height: 0.028inch; RoHS Compliant: Yes; Supplier Part Number 1: RPC0805JT68R0CT-ND
R7 R9 R10 R15 R33 = R_10 k: 10 kOhms ±5% 0.5W, 1/2W Chip Resistor 0805 (2012 Metric) Automotive AEC-Q200, Pulse Withstanding Thick Film; Manufacturer: Panasonic; Manufacturer Part Number: ERJP6WF1002V; Resistance: 10kR; Tolerance: 1%; Power Rating: 500mW; Voltage Rating: 150V; Temperature Coefficient: 200ppm/°C; Supplier 1: Digi-Key; RoHS: Yes; Stock 1: 7791; Pricing 1: 1 = 0.37000, 10 = 0.28600, 100 = 0.12010, 1000 = 0.06624, 2500 = 0.06210 (USD); Case/Package: 0805; Contact Plating: Tin; Case Code (Imperial): 0805; Case Code (Metric): 2012; Min Operating Temperature: -55°C; Max Operating Temperature: 155°C; Resistor Type: Thick Film; Max Power Dissipation: 500mW; Packaging: Cut Tape; Number of Terminations: 2; Termination: Flat; Features: Automotive AEC-Q200; Voltage Rating (DC): 150V; Length: 0.079inch; Width: 0.049inch; Height: 0.03inch; Depth: 1.25mm; REACH SVHC: No SVHC; Lead Free: Lead Free; ComponentLink1URL: https://datasheet.ciiva.com/48531/aoa0000ce4-48531894.pdf?src-supplier=Avnet; ComponentLink1Description: https://datasheet.ciiva.com/48531/aoa0000ce4-48531894.pdf?src-supplier=Avnet; ComponentLink2URL: https://datasheet.ciiva.com/22785/1790600-22785975.pdf?src-supplier=Farnell; ComponentLink2Description: https://datasheet.ciiva.com/22785/1790600-22785975.pdf?src-supplier=Farnell; Supplier Part Number 1: P16966CT-ND; ComponentLink3URL: https://datasheet.ciiva.com/48531/aoa0000ce4-48531895.pdf?src-supplier=Avnet; ComponentLink3Description: https://datasheet.ciiva.com/48531/aoa0000ce4-48531895.pdf?src-supplier=Avnet
R11 = R_75 ohm: 75 Ohms ±1% 0.25W, 1/4W Chip Resistor 0805 (2012 Metric) Anti-Sulfur, Moisture Resistant Thin Film; Manufacturer: Stackpole Electronics; Manufacturer Part Number: RNCP0805FTD75R0; Max Power Dissipation: 250mW; Temperature Coefficient: 100ppm/°C; Supplier 1: Digi-Key; RoHS: Yes; Pricing 1: 1 = 0.10000, 10 = 0.07000, 100 = 0.02830, 1000 = 0.01272, 2500 = 0.01104 (USD); Mount: Surface Mount; Case/Package: 0805; Case Code (Metric): 2012; Case Code (Imperial): 0805; Min Operating Temperature: -55°C; Max Operating Temperature: 155°C; Packaging: Tape and Reel; Resistor Type: Thin Film; Number of Terminations: 2; Tolerance: 1%; Features: Moisture Resistant,Anti-Sulfur; Series: RNCP; Length: 0.079inch; Width: 0.049inch; Height: 0.024inch; RoHS Compliant: Yes; ComponentLink1URL: https://www.seielect.com/catalog/SEI-Packaging.pdf?src-supplier=Digi-Key; ComponentLink1Description: https://www.seielect.com/catalog/SEI-Packaging.pdf?src-supplier=Digi-Key; ComponentLink2URL: http://www.seielect.com/Catalog/SEI-rncp.pdf?src-supplier=Digi-Key; ComponentLink2Description: http://www.seielect.com/Catalog/SEI-rncp.pdf?src-supplier=Digi-Key; Supplier Part Number 1: RNCP0805FTD75R0CT-ND
R12 = R_120 ohm: 120 Ohms ±5% 0.5W, 1/2W Chip Resistor 0805 (2012 Metric) Automotive AEC-Q200, Pulse Withstanding Thick Film; Manufacturer: Panasonic; Manufacturer Part Number: ERJ-P06J121V; Resistance: 120R; Power Rating: 500mW; Voltage Rating: 400V; Temperature Coefficient: 200ppm/°C; Voltage Rating (DC): 150V; ComponentLink1URL: https://datasheet.ciiva.com/11810/0900766b812cb812-11810156.pdf?src-supplier=RSComponents; ComponentLink1Description: https://datasheet.ciiva.com/11810/0900766b812cb812-11810156.pdf?src-supplier=RSComponents; ComponentLink2URL: https://datasheet.ciiva.com/16788/70068906-16788678.pdf?src-supplier=Allied+Electronics; ComponentLink2Description: https://datasheet.ciiva.com/16788/70068906-16788678.pdf?src-supplier=Allied+Electronics; ComponentLink3URL: https://datasheet.ciiva.com/24163/aoa0000ce4-64075-24163318.pdf?src-supplier=Mouser; ComponentLink3Description: https://datasheet.ciiva.com/24163/aoa0000ce4-64075-24163318.pdf?src-supplier=Mouser; ComponentLink4URL: https://datasheet.ciiva.com/7831/aoa0000ce4-7831000.pdf?src-supplier=Element14; ComponentLink4Description: https://datasheet.ciiva.com/7831/aoa0000ce4-7831000.pdf?src-supplier=Element14; ComponentLink5URL: https://datasheet.ciiva.com/17208/aoa0000ce4-17208010.pdf?src-supplier=Avnet+Europe; ComponentLink5Description: https://datasheet.ciiva.com/17208/aoa0000ce4-17208010.pdf?src-supplier=Avnet+Europe; ComponentLink6URL: https://datasheet.ciiva.com/9186/aoa0000ce4-9186844.pdf?src-supplier=Avnet; ComponentLink6Description: https://datasheet.ciiva.com/9186/aoa0000ce4-9186844.pdf?src-supplier=Avnet; ComponentLink7URL: https://datasheet.ciiva.com/16767/70068906-16767564.pdf?src-supplier=Allied+Electronics; ComponentLink7Description: https://datasheet.ciiva.com/16767/70068906-16767564.pdf?src-supplier=Allied+Electronics; Supplier 1: Digi-Key; Supplier Part Number 1: P120ADCT-ND; RoHS: Yes; Stock 1: 16701; Pricing 1: 1 = 0.10000, 10 = 0.09400, 100 = 0.03600, 1000 = 0.01584, 2500 = 0.01368 (USD); Mount: Surface Mount; Case/Package: 0805; Case Code (Metric): 2012; Case Code (Imperial): 0805; Weight: 0.000194oz; Contact Plating: Tin; Min Operating Temperature: -55°C; Max Operating Temperature: 155°C; Tolerance: 5%; Packaging: Tape and Reel; Package Quantity: 1; Resistor Type: Thick Film; Number of Terminations: 2; Termination: SMD/SMT; Max Power Dissipation: 500mW; Features: Automotive AEC-Q200; Series: ERJ; Construction: Rectangular; Resistance Tolerance: 5%; Technology: THICK FILM; Length: 2mm; Width: 0.049inch; Height: 0.6mm; Depth: 1.25mm; Radiation Hardening: No; REACH SVHC: No SVHC; Military Standard: Not; Lead Free: Lead Free; RoHS Compliant: Yes; ComponentLink8URL: https://datasheet.ciiva.com/11811/0900766b812cb812-11811151.pdf?src-supplier=RSComponents; ComponentLink8Description: https://datasheet.ciiva.com/11811/0900766b812cb812-11811151.pdf?src-supplier=RSComponents; ComponentLink9URL: https://datasheet.ciiva.com/9186/aoa0000ce4-9186293.pdf?src-supplier=Avnet; ComponentLink9Description: https://datasheet.ciiva.com/9186/aoa0000ce4-9186293.pdf?src-supplier=Avnet; ComponentLink10URL: https://datasheet.ciiva.com/16769/70068906-16769159.pdf?src-supplier=Allied+Electronics; ComponentLink10Description: https://datasheet.ciiva.com/16769/70068906-16769159.pdf?src-supplier=Allied+Electronics; ComponentLink11URL: https://datasheet.ciiva.com/24159/aoa0000ce4-64075-24159096.pdf?src-supplier=Mouser; ComponentLink11Description: https://datasheet.ciiva.com/24159/aoa0000ce4-64075-24159096.pdf?src-supplier=Mouser; ComponentLink12URL: https://datasheet.ciiva.com/30235/aoa0000ce4-30235964.pdf?src-supplier=Onlinecomponents.com; ComponentLink12Description: https://datasheet.ciiva.com/30235/aoa0000ce4-30235964.pdf?src-supplier=Onlinecomponents.com; ComponentLink13URL: https://datasheet.ciiva.com/17207/aoa0000ce4-17207741.pdf?src-supplier=Avnet+Europe; ComponentLink13Description: https://datasheet.ciiva.com/17207/aoa0000ce4-17207741.pdf?src-supplier=Avnet+Europe; ComponentLink14URL: https://datasheet.ciiva.com/6082/aoa0000ce4-6082638.pdf?src-supplier=Farnell; ComponentLink14Description: https://datasheet.ciiva.com/6082/aoa0000ce4-6082638.pdf?src-supplier=Farnell
R14 = R_47 ohm: 47 Ohms ±5% 0.5W, 1/2W Chip Resistor 0805 (2012 Metric) Automotive AEC-Q200, Pulse Withstanding Thick Film; Manufacturer: Panasonic; Manufacturer Part Number: ERJ-P6WF47R0V; Voltage Rating (DC): 150V; Tolerance: 1%; Power Rating: 500mW; Resistance: 47R; Temperature Coefficient: 200ppm/°C; Supplier 1: Digi-Key; RoHS: Yes; Stock 1: 46649; Pricing 1: 1 = 0.10000, 10 = 0.09400, 100 = 0.03600, 1000 = 0.01584, 2500 = 0.01368 (USD); Case/Package: 0805; Case Code (Metric): 2012; Contact Plating: Tin; Case Code (Imperial): 0805; Min Operating Temperature: -55°C; Max Operating Temperature: 155°C; Number of Terminations: 2; Termination: Flat; Voltage Rating: 150V; Packaging: Cut Tape; Resistor Type: Thick Film; Features: Automotive AEC-Q200; Max Power Dissipation: 500mW; Length: 0.079inch; Width: 0.049inch; Height: 0.03inch; Depth: 1.25mm; REACH SVHC: No SVHC; ComponentLink1URL: https://datasheet.ciiva.com/11815/0900766b812cb812-11815917.pdf?src-supplier=RSComponents; ComponentLink1Description: https://datasheet.ciiva.com/11815/0900766b812cb812-11815917.pdf?src-supplier=RSComponents; ComponentLink2URL: https://datasheet.ciiva.com/17209/aoa0000ce4-17209589.pdf?src-supplier=Avnet+Europe; ComponentLink2Description: https://datasheet.ciiva.com/17209/aoa0000ce4-17209589.pdf?src-supplier=Avnet+Europe; ComponentLink3URL: https://datasheet.ciiva.com/9189/aoa0000ce4-9189447.pdf?src-supplier=Avnet; ComponentLink3Description: https://datasheet.ciiva.com/9189/aoa0000ce4-9189447.pdf?src-supplier=Avnet; ComponentLink4URL: https://datasheet.ciiva.com/7887/aoa0000ce4-7887048.pdf?src-supplier=Element14; ComponentLink4Description: https://datasheet.ciiva.com/7887/aoa0000ce4-7887048.pdf?src-supplier=Element14; Supplier Part Number 1: P47ADCT-ND; Mount: Surface Mount; Package Quantity: 1; Radiation Hardening: No; Military Standard: Not; Lead Free: Lead Free; ComponentLink5URL: https://datasheet.ciiva.com/30108/aoa0000ce4-30108030.pdf?src-supplier=Onlinecomponents.com; ComponentLink5Description: https://datasheet.ciiva.com/30108/aoa0000ce4-30108030.pdf?src-supplier=Onlinecomponents.com
R16 = R_200 ohm: 200 Ohms ±0.1% 0.125W, 1/8W Chip Resistor 0805 (2012 Metric) Automotive AEC-Q200 Thin Film; Manufacturer: Panasonic; Manufacturer Part Number: ERJ-P06F2000V; Temperature Coefficient: 100ppm/°C; Voltage Rating (DC): 150V; Resistance: 200R; Power Rating: 500mW; Tolerance: 1%; Supplier 1: Digi-Key; RoHS: Yes; Stock 1: 15886; Pricing 1: 1 = 0.31000, 10 = 0.26200, 100 = 0.10230, 1000 = 0.04284, 2500 = 0.03927 (USD); Mount: Surface Mount; Case/Package: 0805; Number of Pins: 2; Case Code (Imperial): 0805; Case Code (Metric): 2012; Contact Plating: Tin; Min Operating Temperature: -55°C; Max Operating Temperature: 155°C; Resistor Type: Thick Film; Voltage Rating: 150V; Packaging: Tape and Reel; Package Quantity: 5000; Termination: Wraparound; Length: 2mm; Width: 1.2mm; Height: 0.6mm; Depth: 1.25mm; Lead Free: Lead Free; Military Standard: Not; REACH SVHC: No SVHC; ComponentLink1URL: https://datasheet.ciiva.com/11811/0900766b812cb812-11811594.pdf?src-supplier=RSComponents; ComponentLink1Description: https://datasheet.ciiva.com/11811/0900766b812cb812-11811594.pdf?src-supplier=RSComponents; ComponentLink2URL: https://datasheet.ciiva.com/24026/aoa0000ce4-64075-24026537.pdf?src-supplier=Mouser; ComponentLink2Description: https://datasheet.ciiva.com/24026/aoa0000ce4-64075-24026537.pdf?src-supplier=Mouser; ComponentLink3URL: https://datasheet.ciiva.com/9184/aoa0000ce4-9184694.pdf?src-supplier=Avnet; ComponentLink3Description: https://datasheet.ciiva.com/9184/aoa0000ce4-9184694.pdf?src-supplier=Avnet; ComponentLink4URL: https://datasheet.ciiva.com/30051/aoa0000ce4-30051223.pdf?src-supplier=Onlinecomponents.com; ComponentLink4Description: https://datasheet.ciiva.com/30051/aoa0000ce4-30051223.pdf?src-supplier=Onlinecomponents.com; ComponentLink5URL: https://datasheet.ciiva.com/29184/452790-da-01-en-widerstand-0805-era-29184068.pdf?src-supplier=Conrad; ComponentLink5Description: https://datasheet.ciiva.com/29184/452790-da-01-en-widerstand-0805-era-29184068.pdf?src-supplier=Conrad; Supplier Part Number 1: P200DACT-ND; Number of Terminations: 2; Max Power Dissipation: 500mW; Features: Automotive AEC-Q200; Series: ERJ; Construction: Rectangular; Technology: THICK FILM; Radiation Hardening: No; RoHS Compliant: Yes; Size Code: 0805; Resistance Tolerance: 0.1%; ComponentLink6URL: https://datasheet.ciiva.com/16769/70068849-16769175.pdf?src-supplier=Allied+Electronics; ComponentLink6Description: https://datasheet.ciiva.com/16769/70068849-16769175.pdf?src-supplier=Allied+Electronics; ComponentLink7URL: https://datasheet.ciiva.com/43457/485442-43457863.pdf?src-supplier=Farnell; ComponentLink7Description: https://datasheet.ciiva.com/43457/485442-43457863.pdf?src-supplier=Farnell; ComponentLink8URL: https://datasheet.ciiva.com/9184/aoa0000ce26-9184632.pdf?src-supplier=Avnet; ComponentLink8Description: https://datasheet.ciiva.com/9184/aoa0000ce26-9184632.pdf?src-supplier=Avnet; ComponentLink9URL: https://datasheet.ciiva.com/30158/54aoa0000ce26-30158504.pdf?src-supplier=Onlinecomponents.com; ComponentLink9Description: https://datasheet.ciiva.com/30158/54aoa0000ce26-30158504.pdf?src-supplier=Onlinecomponents.com; ComponentLink10URL: https://datasheet.ciiva.com/48425/era-eng-tds-48425774.pdf?src-supplier=Distrelec; ComponentLink10Description: https://datasheet.ciiva.com/48425/era-eng-tds-48425774.pdf?src-supplier=Distrelec; ComponentLink11URL: https://datasheet.ciiva.com/16781/70068849-16781071.pdf?src-supplier=Allied+Electronics; ComponentLink11Description: https://datasheet.ciiva.com/16781/70068849-16781071.pdf?src-supplier=Allied+Electronics; ComponentLink12URL: https://datasheet.ciiva.com/17207/aoa0000ce26-17207007.pdf?src-supplier=Avnet+Europe; ComponentLink12Description: https://datasheet.ciiva.com/17207/aoa0000ce26-17207007.pdf?src-supplier=Avnet+Europe